# Altium schematic sheet RF.SchDoc
size A4; SheetNumber: 3; SheetTotal: 3
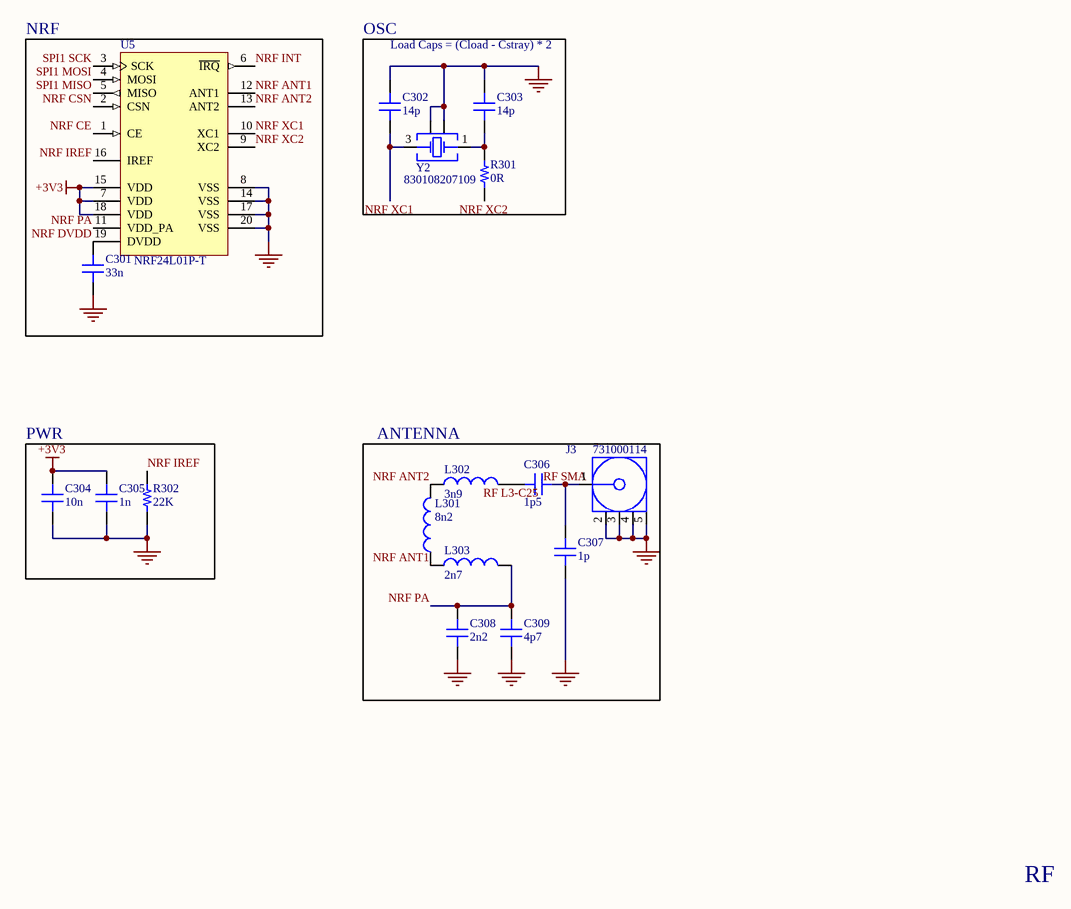
[diagram p0: RF.SchDoc]

## Parts
C301  33n  [CAP 0402_1005]
C302  14p  [CAP 0402_1005]
C303  14p  [CAP 0402_1005]
C304  10n  [CAP 0402_1005]
C305  1n  [CAP 0402_1005]
C306  1p5  [CAP 0402_1005]
C307  1p  [CAP 0402_1005]
C308  2n2  [CAP 0402_1005]
C309  4p7  [CAP 0402_1005]
J3  731000114  [MOLX-731000114_V]
L301  8n2  [WE-TCI_0402]
L302  3n9  [WE-TCI_0402]
L303  2n7  [WE-TCI_0402]
R301  0R  [RES 0402_1005]
R302  22K  [RES 0402_1005]
U5  NRF24L01P-T  [NRSC-QFN-20_L]
Y2  830108207109  [WE-XTAL_CFPX-180]

## Blocks framed on the sheet
NRF: C301 U5
OSC: C302 C303 R301 Y2
PWR: C304 C305 R302
ANTENNA: C306-C309 J3 L301-L303

## Nets
+3V3: C304.2 C305.2 U5.7(VDD) U5.15(VDD) U5.18(VDD)
GND: C301.1 C302.2 C303.2 C304.1 C305.1 C307.1 C308.1 C309.1 J3.2 J3.3 J3.4 J3.5 R302.2 U5.8(VSS) U5.14(VSS) U5.17(VSS) U5.20(VSS) Y2.2(GND&Lid) Y2.4(GND&Lid)
NRF ANT1: L301.1 L303.1 U5.12(ANT1)
NRF ANT2: L301.2 L302.1 U5.13(ANT2)
NRF CE: U5.1(CE)
NRF CSN: U5.2(CSN)
NRF DVDD: C301.2 U5.19(DVDD)
NRF INT: U5.6(~{IRQ})
NRF IREF: R302.1 U5.16(IREF)
NRF PA: C308.2 C309.2 L303.2 U5.11(VDD_PA)
NRF XC1: C302.1 U5.10(XC1) Y2.3(Crystal)
NRF XC2: R301.2 U5.9(XC2)
RF L3-C25: C306.2 L302.2
RF SMA: C306.1 C307.2 J3.1
SPI1 MISO: U5.5(MISO)
SPI1 MOSI: U5.4(MOSI)
SPI1 SCK: U5.3(SCK)
NetC303_1: C303.1 R301.1 Y2.1(Crystal)

## Notes on the sheet
- Load Caps = (Cload - Cstray) * 2
- RF

## Library data of the parts
C301 = C0402C330J4RACAUTO: CAP CER 33PF 16V X7R 0402; manufacturer: KEMET; Tolerance: ±5%; Part Number: C0402C330J4RACAUTO; Value: 33n; Applications: Automotive, Bypass, Decoupling; Capacitance: 33 pF; componentlink1description: Datasheet; componentlink1url: https://api.kemet.com/component-edge/download/datasheet/C0402C330J4RACAUTO.pdf; componentlink2description: DigiKey Link; componentlink2url: https://www.digikey.com/en/products/detail/kemet/C0402C330J4RACAUTO/6219618; Device Package: 0402 (1005 Metric); lastupdated: 23/01/2024 8:04:40 PM; Lifecycle Status: Active; Minimum Order: 1; Mounting Type: Surface Mount, MLCC; Operating Temperature: -55°C ~ 125°C; Package / Case: 0402 (1005 Metric); packaging: TapeAndReel; partid: 1721; Part Status: Active; price: 0.01; Ratings: AEC-Q200; series: SMD Auto X7R; Size / Dimension: 0.039" L x 0.020" W (1.00mm x 0.50mm); Supplier 1: DigiKey; Supplier Part Number 1: 399-13708-1-ND; Temperature Coefficient: X7R; Thickness (Max): 0.022" (0.55mm); Voltage - Rated: 16V
C302 C303 = GJM1555C1H140GB01D: CAP CER 14PF 50V C0G/NP0 0402; Part Number: GJM1555C1H140GB01D
C304-C309 = C0402C103K4REC7867: CAP CER 0402 10NF 16V X7R 10%; manufacturer: KEMET; Capacitance: 10000 pF; Part Number: C0402C103K4REC7867; Applications: ESD Protection; componentlink1description: Datasheet; componentlink1url: https://connect.kemet.com:7667/gateway/IntelliData-ComponentDocumentation/1.0/download/datasheet/C0402C103K4REC7867; componentlink2description: DigiKey Link; componentlink2url: https://www.digikey.com/en/products/detail/kemet/C0402C103K4REC7867/8643577; Device Package: 0402 (1005 Metric); lastupdated: 23/01/2024 8:03:47 PM; Lifecycle Status: Active; Minimum Order: 1; Mounting Type: Surface Mount, MLCC; Operating Temperature: -55°C ~ 125°C; Package / Case: 0402 (1005 Metric); packaging: TapeAndReel; partid: 52124; Part Status: Active; price: 0.01; series: ESD SMD Comm X7R; Size / Dimension: 0.039" L x 0.020" W (1.00mm x 0.50mm); Supplier 1: DigiKey; Supplier Part Number 1: 399-C0402C103K4REC7867CT-ND; Temperature Coefficient: X7R; Thickness (Max): 0.022" (0.55mm); Tolerance: ±10%; Voltage - Rated: 16V
  C304: Value: 10n
  C305: Value: 1n
  C306: Value: 1p5
  C307: Value: 1p
  C308: Value: 2n2
  C309: Value: 4p7
J3 = CMP-2000-05487-1: SMA Right-Angle PCB Jack Receptacle, Brass Body, Gold Plated, 50 Ohm, 5-Pin THD, RoHS, Tray; Manufacturer: Molex; Datasheet Version: 09/2016; Package Description: 5-Pin Through Hole Device, Body 14.8 x 6.35 mm, Pitch 2.54 mm; Datasheet URL: http://www.molex.com/webdocs/datasheets/pdf/en-us/0731000114_RF_COAX_CONNECTORS.pdf; Manufacturer URL: http://www.molex.com/; Package Reference: 731000114; Mounting Technology: ThroughHole; Package URL: http://www.molex.com/pdm_docs/sd/731000114_sd.pdf
L301-L303 = CMP-03913-14415878-1: 744901039 Fixed Ind 3.9NH 340MA 500MOHM Sm; Self Resonant Frequency: 6GHz; Q Factor: 13; Core Material: Alumina; Test Frequency: 500MHz; DC Resistance (DCR): 370mΩ; Shielding: Unshielded; Inductance: 3.9nH; Case Code (Imperial): 0402; Termination: SMD/SMT; NexarPartId: 14415878; RoHS: Compliant; Packaging: Digi-Reel®; Min Operating Temperature: -40°C; Composition: Thin Film; Case Code (Metric): 1005; Current Rating: 340mA; Weight: 652.039032µg; Max DC Current: 340mA; Length: 1mm; Width: 500µm; REACH SVHC: Unknown; Case/Package: 0402; Height - Seated (Max): 406.4µm; Number of Pins: 2; Height: 320µm; Mount: Surface Mount; Max Operating Temperature: 125°C
R301 = 5112: 0402 JUMPER ON TAPE AND REEL; Part Number: 5112
R302 = RC0402FR-0722K1L: RES 22.1K OHM 1% 1/16W 0402; Manufacturer: Yageo; Power (Watts): 0.063W, 1/16W; Resistance: 22.1 kOhms; Temperature Coefficient: ±100ppm/°C; Part Number: RC0402FR-0722K1L; Value: 22K; ComponentLink1Description: Datasheet; ComponentLink1URL: https://www.yageo.com/upload/media/product/productsearch/datasheet/rchip/PYu-RC_Group_51_RoHS_L_10.pdf; ComponentLink2Description: DigiKey Link; ComponentLink2URL: https://www.digikey.com/en/products/detail/yageo/RC0402FR-0722K1L/726563; Composition: Thick Film; Device Package: 0402 (1005 Metric); Features: Moisture Resistant; Height - Seated (Max): 0.016" (0.40mm); LastUpdated: 23/01/2024 8:29:15 PM; Lifecycle Status: Active; Minimum Order: 1; Number of Terminations: 2; Operating Temperature: -55°C ~ 155°C; Package / Case: 0402 (1005 Metric); Packaging: CutTape; PartId: 2641; Part Status: Active; Price: 0.01; Series: RC_L; Size / Dimension: 0.039" L x 0.020" W (1.00mm x 0.50mm); Supplier 1: DigiKey; Supplier Part Number 1: 311-22.1KLRCT-ND; Supplier Device Package: 0402; Tolerance: ±1%
U5 = CMP-2000-06859-1: Single Chip Transceiver, 2.4 GHz, 60 mW, 1.9 to 3.6 V, -40 to 85 degC, 20-Pin QFN, RoHS, Tray; Manufacturer: Nordic Semiconductor; Data Rate (Max): 2Mbps; Current - Transmitting: 7mA~11.3mA; Power - Output: 0dBm; Other Names: 1490-1019; Online Catalog: nRF24L01+; Current - Receiving: 12.6mA~13.5mA; For Use With: 1490-1002-ND-KITEVALUATIONNRF24L01P1568-1295-ND-SPARKFUNTRANSCEIVERBREAKOUT-1568-1296-ND-SPARKFUNTRANSCEIVERBREAKOUT-1471-1410-ND-DEVBOARDNRFSCLICKNRF24L01P-MODULE-PCB-ND-KITEVALNRF24L01+PCBANTENNANRF24L01P-MODULE-SMA-ND-KITEVALNRF24L01+SMACONNNRF24L01P-UPGRADE-ND-UPGRADE2PCB/1SMANRF24L01103990038-ND-DEVDUINOSENSORNODEV1.3103990053-ND-DEVDUINOSENSORNODEV2(ATMEGA103990074-ND-DEVDUINOSENSORNODE106990026-ND-ENERGYMONITORSHIELDV2113990088-ND-WIRELESSGATESHIELD113990095-ND-DEVDUINOSENSORNODEV3(ATMEGA106030001-ND-ENERGYMONITORSHIELD1597-1361-ND-DEVDUINOSENSORNODEV2.2(ATMEG105990030-ND-RGBWSTRIPWIRELESSSHIELDV1.0; Frequency: 2.4GHz; Design Resources: DevelopmentToolSelector; RF Family/Standard: GeneralISM>1GHZ; Serial Interfaces: SPI; Sensitivity: -94dBm; Voltage - Supply: 1.9V~3.6V; Modulation: GFSK; GPIO: -; Package Reference: QFN20; Memory Size: -; Category: RF/IFandRFID; Type: TxRxOnly; Standard Package: 490; Package / Case: 20-VFQFNExposedPad; Packaging: Tray; Series: -; Package Description: 20-Pin Quad Flat No-lead Package, Body 4 x 4 mm, Pitch 0.5 mm; Datasheet Version: Rev. 1.0, 09/2008; Protocol: -; Manufacturer URL: http://www.nordicsemi.com/eng/Products/; Operating Temperature: -40°C~85°C; Family: RFTransceiverICs; Datasheet URL: http://www.nordicsemi.com/eng/content/download/2726/34069/file/nRF24L01P_Product_Specification_1_0.pdf; Mounting Technology: SurfaceMount
Y2 = CMP-03913-116855757-1: 830108207109 WE-XTAL Quartz Crystal; Frequency: 16MHz; Width: 2.5mm; Max Operating Temperature: 85°C; Height: 800µm; NexarPartId: 116855757; Min Operating Temperature: -40°C; Length: 3.2mm